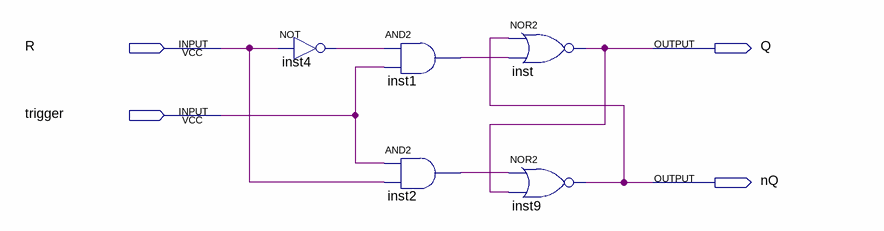
[diagram p0: schematic sheet]
// Quartus schematic latch_d.bdf as structural Verilog: 5 symbols, 4 pins
module latch_d (
  input  R,
  input  trigger,
  output Q,
  output nQ
);

  wire inst1_out, inst2_out, inst4_out;

  not inst4 (inst4_out, R);
  and inst1 (inst1_out, inst4_out, trigger);
  and inst2 (inst2_out, trigger, R);
  nor inst (Q, nQ, inst1_out);
  nor inst9 (nQ, inst2_out, Q);
endmodule
